# EAGLE design lp_analog_small (EAGLE 6.5.0)
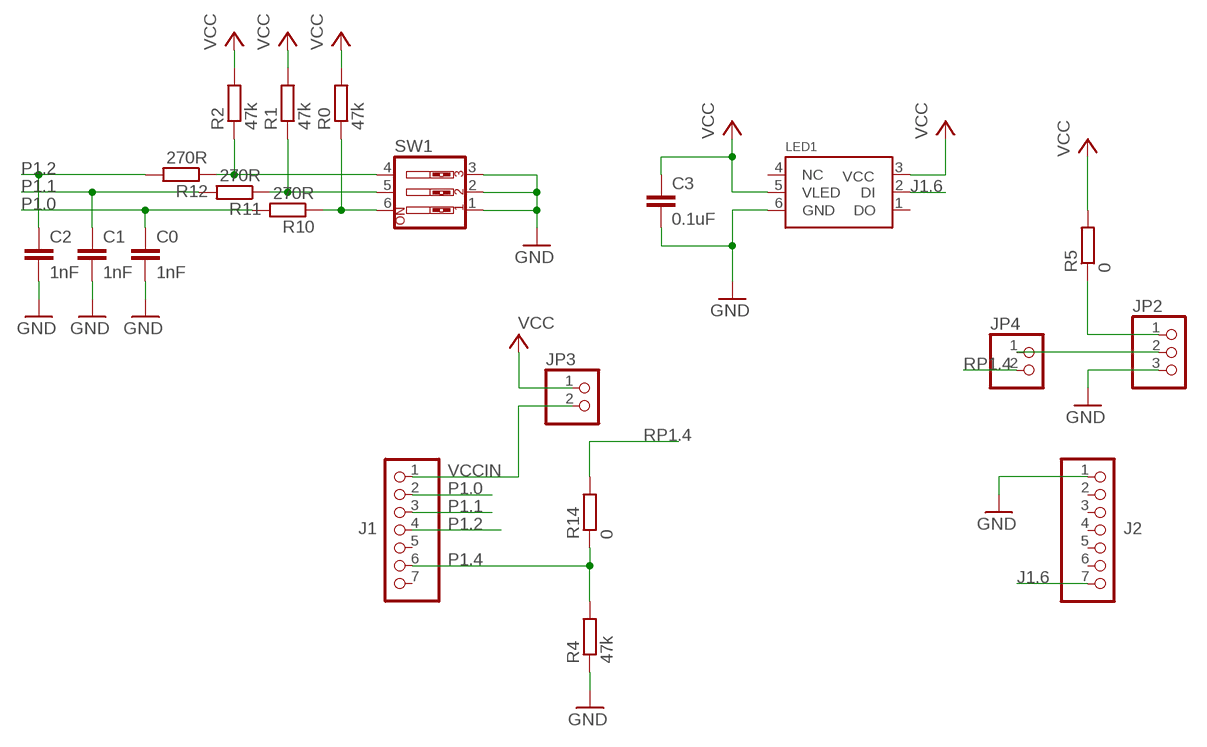
[diagram p0: schematic, sheet 1]

## Parts
C0  1nF  C-EUC0805  [C0805]
C1  1nF  C-EUC0805  [C0805]
C2  1nF  C-EUC0805  [C0805]
C3  0.1uF  C-EUC0805  [C0805]
J1  PINHD-1X7  [1X07]
J2  PINHD-1X7  [1X07]
JP2  PINHD-1X3  [1X03]
JP3  PINHD-1X2  [1X02]
JP4  PINHD-1X2  [1X02]
LED1  5050WS2811W  [RGBLED5050W]
R0  47k  R-EU_R0805  [R0805]
R1  47k  R-EU_R0805  [R0805]
R2  47k  R-EU_R0805  [R0805]
R4  47k  R-EU_R0805  [R0805]
R5  0  R-EU_R0805  [R0805]
R10  270R  R-EU_R0805  [R0805]
R11  270R  R-EU_R0805  [R0805]
R12  270R  R-EU_R0805  [R0805]
R14  0  R-EU_R0805  [R0805]
SW1  SW_DIP-3  [EDG-03]

## Nets
GND [GND]: C0.2 C1.2 C2.2 C3.2 J2.1 JP2.3 LED1.6(GND) R4.1 SW1.1 SW1.2 SW1.3
J1.6: J2.7 LED1.2(DI)
N$2: R2.1 R12.1 SW1.4
N$3: R1.1 R11.1 SW1.5
N$4: JP2.2 JP4.1
N$5 [VCC]: JP2.1 R5.1
N$8: R0.1 R10.1 SW1.6
P1.0: C0.1 J1.2 R10.2
P1.1: C1.1 J1.3 R11.2
P1.2: C2.1 J1.4 R12.2
P1.4: J1.6 R4.2 R14.1
RP1.4: JP4.2 R14.2
VCC [VCC]: C3.1 JP3.1 LED1.3(VCC) LED1.5(VLED) R0.2 R1.2 R2.2 R5.2
VCCIN [VCC]: J1.1 JP3.2
Unconnected: J1.5 J1.7 J2.2 J2.3 J2.4 J2.5 J2.6 LED1.1(DO) LED1.4(NC)

## Library data of the parts
C0 C1 C2 = resistor:C-EU: CAPACITOR, European symbol
C3 = rcl:C-EU: CAPACITOR, European symbol
J1 J2 = pinhead:PINHD-1X7: PIN HEADER
JP2 = pinhead:PINHD-1X3: PIN HEADER
JP3 JP4 = pinhead:PINHD-1X2: PIN HEADER
LED1 = 5050WS2811:5050WS2811
R0 R1 R2 R4 R5 R10-R12 R14 = resistor:R-EU_: RESISTOR, European symbol
SW1 = special:SW_DIP-3: DIP SWITCH

## Net classes
0 default: width 0.406 mm, drill 0.508 mm
1 GND: width 0.508 mm, drill 0.508 mm
2 VCC: width 1.016 mm, drill 0.508 mm
4 VCCEXT: width 0.762 mm, drill 0.508 mm, clearance 0.229 mm

## Board
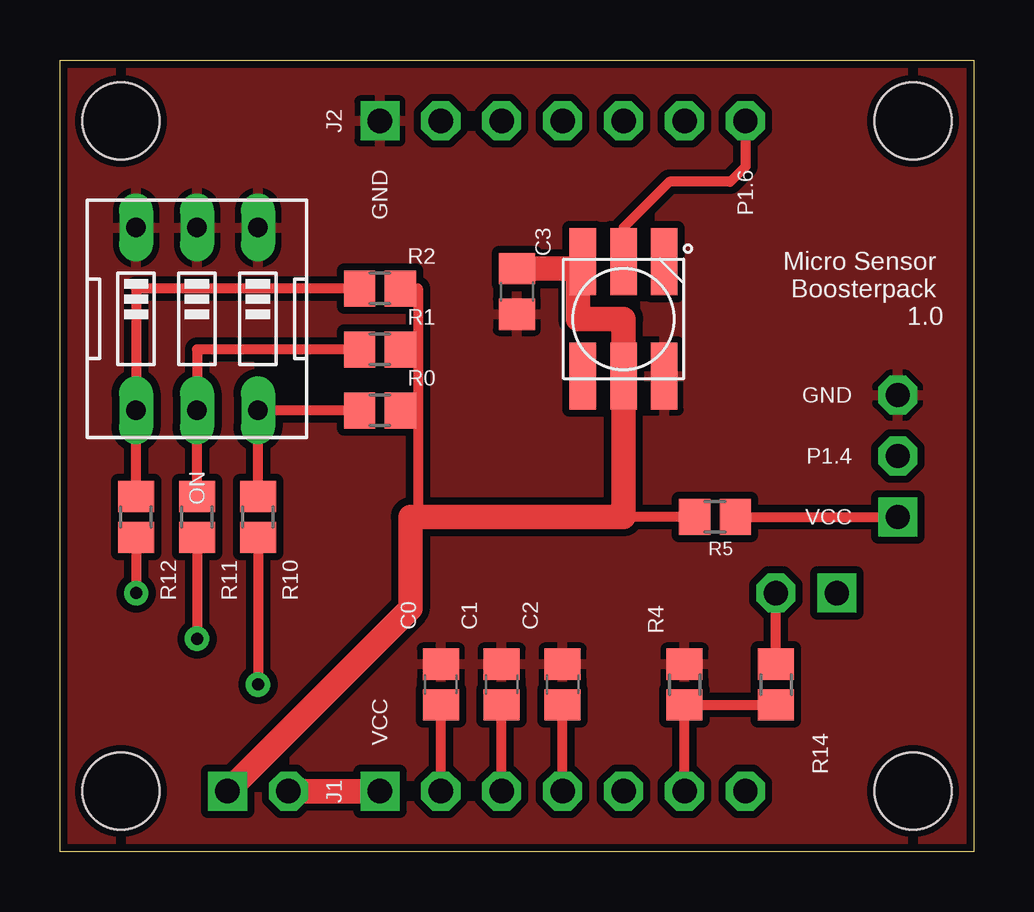
[diagram p1: board, top side]
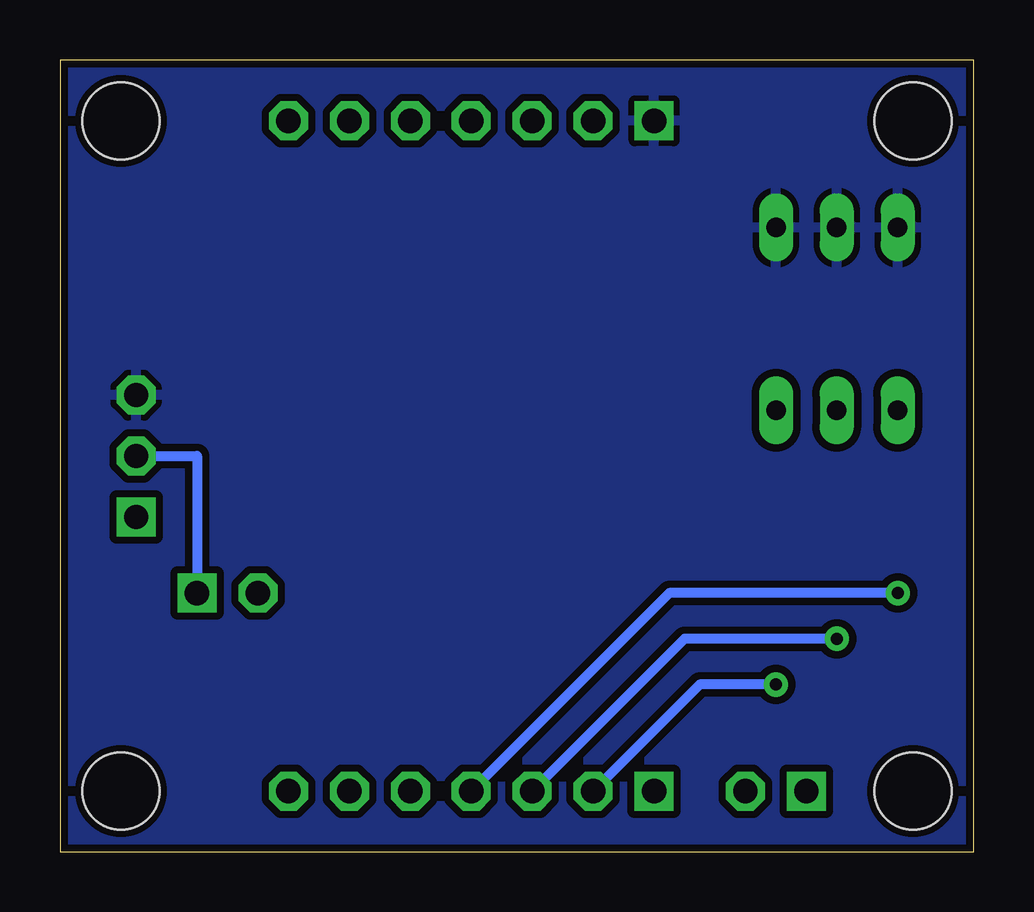
[diagram p2: board, bottom side, seen from below]

Size 38.1 x 33.02 mm. Coordinates in mm from the lower left corner, seen from the top.
Outline: 0,33.02 38.1,33.02 38.1,0 0,0 0,33.02
Copper layers (1*16): Top 0.035mm / dielectric 1.5mm / Bottom 0.035mm
Design rules "SparkFun": minimum track width 8mil, minimum drill 20mil, track to track 8mil, track to pad 8mil, pad to pad 8mil, via to via 8mil, smd to smd 8mil, copper to edge 10mil, drill to drill 8mil, minimum pad ring 12mil, minimum via ring 10mil, stop-mask expansion 4mil, vias tented up to drill 25mil, thermal gap 10mil
Holes 3.2 mm at 2.54,30.48 35.56,30.48 35.56,2.54 2.54,2.54

### Footprints (pad centres in the part's own frame; a part is rotated, then mirrored left to right if it is on the bottom)
C0805 = smd 1.3 x 1.5: 1 -0.85,0; 2 0.85,0
C0805' = smd 1.3 x 1.5: 1 -0.95,0; 2 0.95,0
1X07 = drill 1.016 square: 1 -7.62,0 | drill 1.016 octagon: 2 -5.08,0; 3 -2.54,0; 4 0,0; 5 2.54,0; 6 5.08,0; 7 7.62,0
1X03 = drill 1.016 square: 1 -2.54,0 | drill 1.016 octagon: 2 0,0; 3 2.54,0
1X02 = drill 1.016 square: 1 -1.27,0 | drill 1.016 octagon: 2 1.27,0
RGBLED5050W = smd 2.794 x 1.1: 1 -2.381,1.7; 2 -2.381,0; 3 -2.381,-1.7; 4 2.381,-1.7; 5 2.381,0; 6 2.381,1.7
R0805 = smd 1.3 x 1.5: 1 -0.85,0; 2 0.85,0
EDG-03 = drill 0.813 long: 1 -2.54,-3.81; 2 0,-3.81; 3 2.54,-3.81; 4 2.54,3.81; 5 0,3.81; 6 -2.54,3.81

### Placement (x,y rotation side)
C0  15.88,6.99 90 top
C1  18.41,6.99 90 top
C2  20.95,6.99 90 top
C3  0.1uF  [C0805']  19.05,23.37 270 top
J1  20.95,2.54 0 top
J2  20.95,30.48 0 top
JP2  34.92,16.51 90 top
JP3  8.26,2.54 0 top
JP4  31.12,10.79 180 top
LED1  23.49,22.23 270 top
R0  13.34,18.41 0 top
R1  13.34,20.95 0 top
R2  13.34,23.5 0 top
R4  26.04,6.99 270 top
R5  27.3,13.97 180 top
R10  8.26,13.97 270 top
R11  5.71,13.97 270 top
R12  3.17,13.97 270 top
R14  29.84,6.99 90 top
SW1  5.71,22.23 180 top

### Tracks (layer width: path | path; a pad name or v marks a point on that pad's centre or on a via)
GND
  pour Top (isolate 0.305): -0.89,-0.51 39.75,-0.51 39.75,34.16 -0.89,34.16
  pour Bottom (isolate 0.305): -0.89,-0.51 39.75,-0.51 39.75,34.16 -0.89,34.16
J1.6
  Top 0.406: J2.7 28.57,28.57 27.94,27.94 25.4,27.94 23.49,26.04 LED1.2
N$2
  Top 0.406: R12.1 SW1.4 3.17,23.5 R2.1
N$3
  Top 0.406: R11.1 SW1.5 5.71,20.95 R1.1
N$4
  Bottom 0.406: JP2.2 32.38,16.51 JP4.1
N$5
  Top 0.406: R5.1 JP2.1
N$8
  Top 0.406: R10.1 SW1.6 R0.1
P1.0  (via drill 0.51)
  Top 0.406: J1.2 C0.1 | R10.2 v8.26,6.99
  Bottom 0.406: v8.26,6.99 11.43,6.99 J1.2
P1.1  (via drill 0.51)
  Top 0.406: J1.3 C1.1 | R11.2 v5.71,8.89
  Bottom 0.406: v5.71,8.89 12.07,8.89 J1.3
P1.2  (via drill 0.51)
  Top 0.406: R12.2 v3.17,10.79 | J1.4 C2.1
  Bottom 0.406: v3.17,10.79 12.7,10.79 J1.4
P1.4
  Top 0.406: J1.6 R4.2 R14.1
RP1.4
  Top 0.406: R14.2 JP4.2
VCC
  Top 0.406: R0.2 14.92,18.41 | R1.2 14.92,20.95 | 14.92,20.95 14.92,18.41 | R2.2 14.92,23.5 14.92,20.95 | 14.92,18.41 14.92,14.29 14.61,13.97 | LED1.3 19.21,24.61 19.05,24.77 C3.1 | R5.2 23.49,13.97
  Top 1.016: JP3.1 14.61,10.16 14.61,13.97 23.49,13.97 LED1.5 23.49,22.23 21.59,22.23 21.59,24.13 21.4,24.32 C3.1
VCCIN
  Top 1.016: J1.1 JP3.2

### Text on the board
tNames: GND | P1.6 | Micro Sensor / Boosterpack / 1.0 | GND | P1.4 | ON | VCC | VCC